# EAGLE schematic voltage_reference (EAGLE 7.5.0)
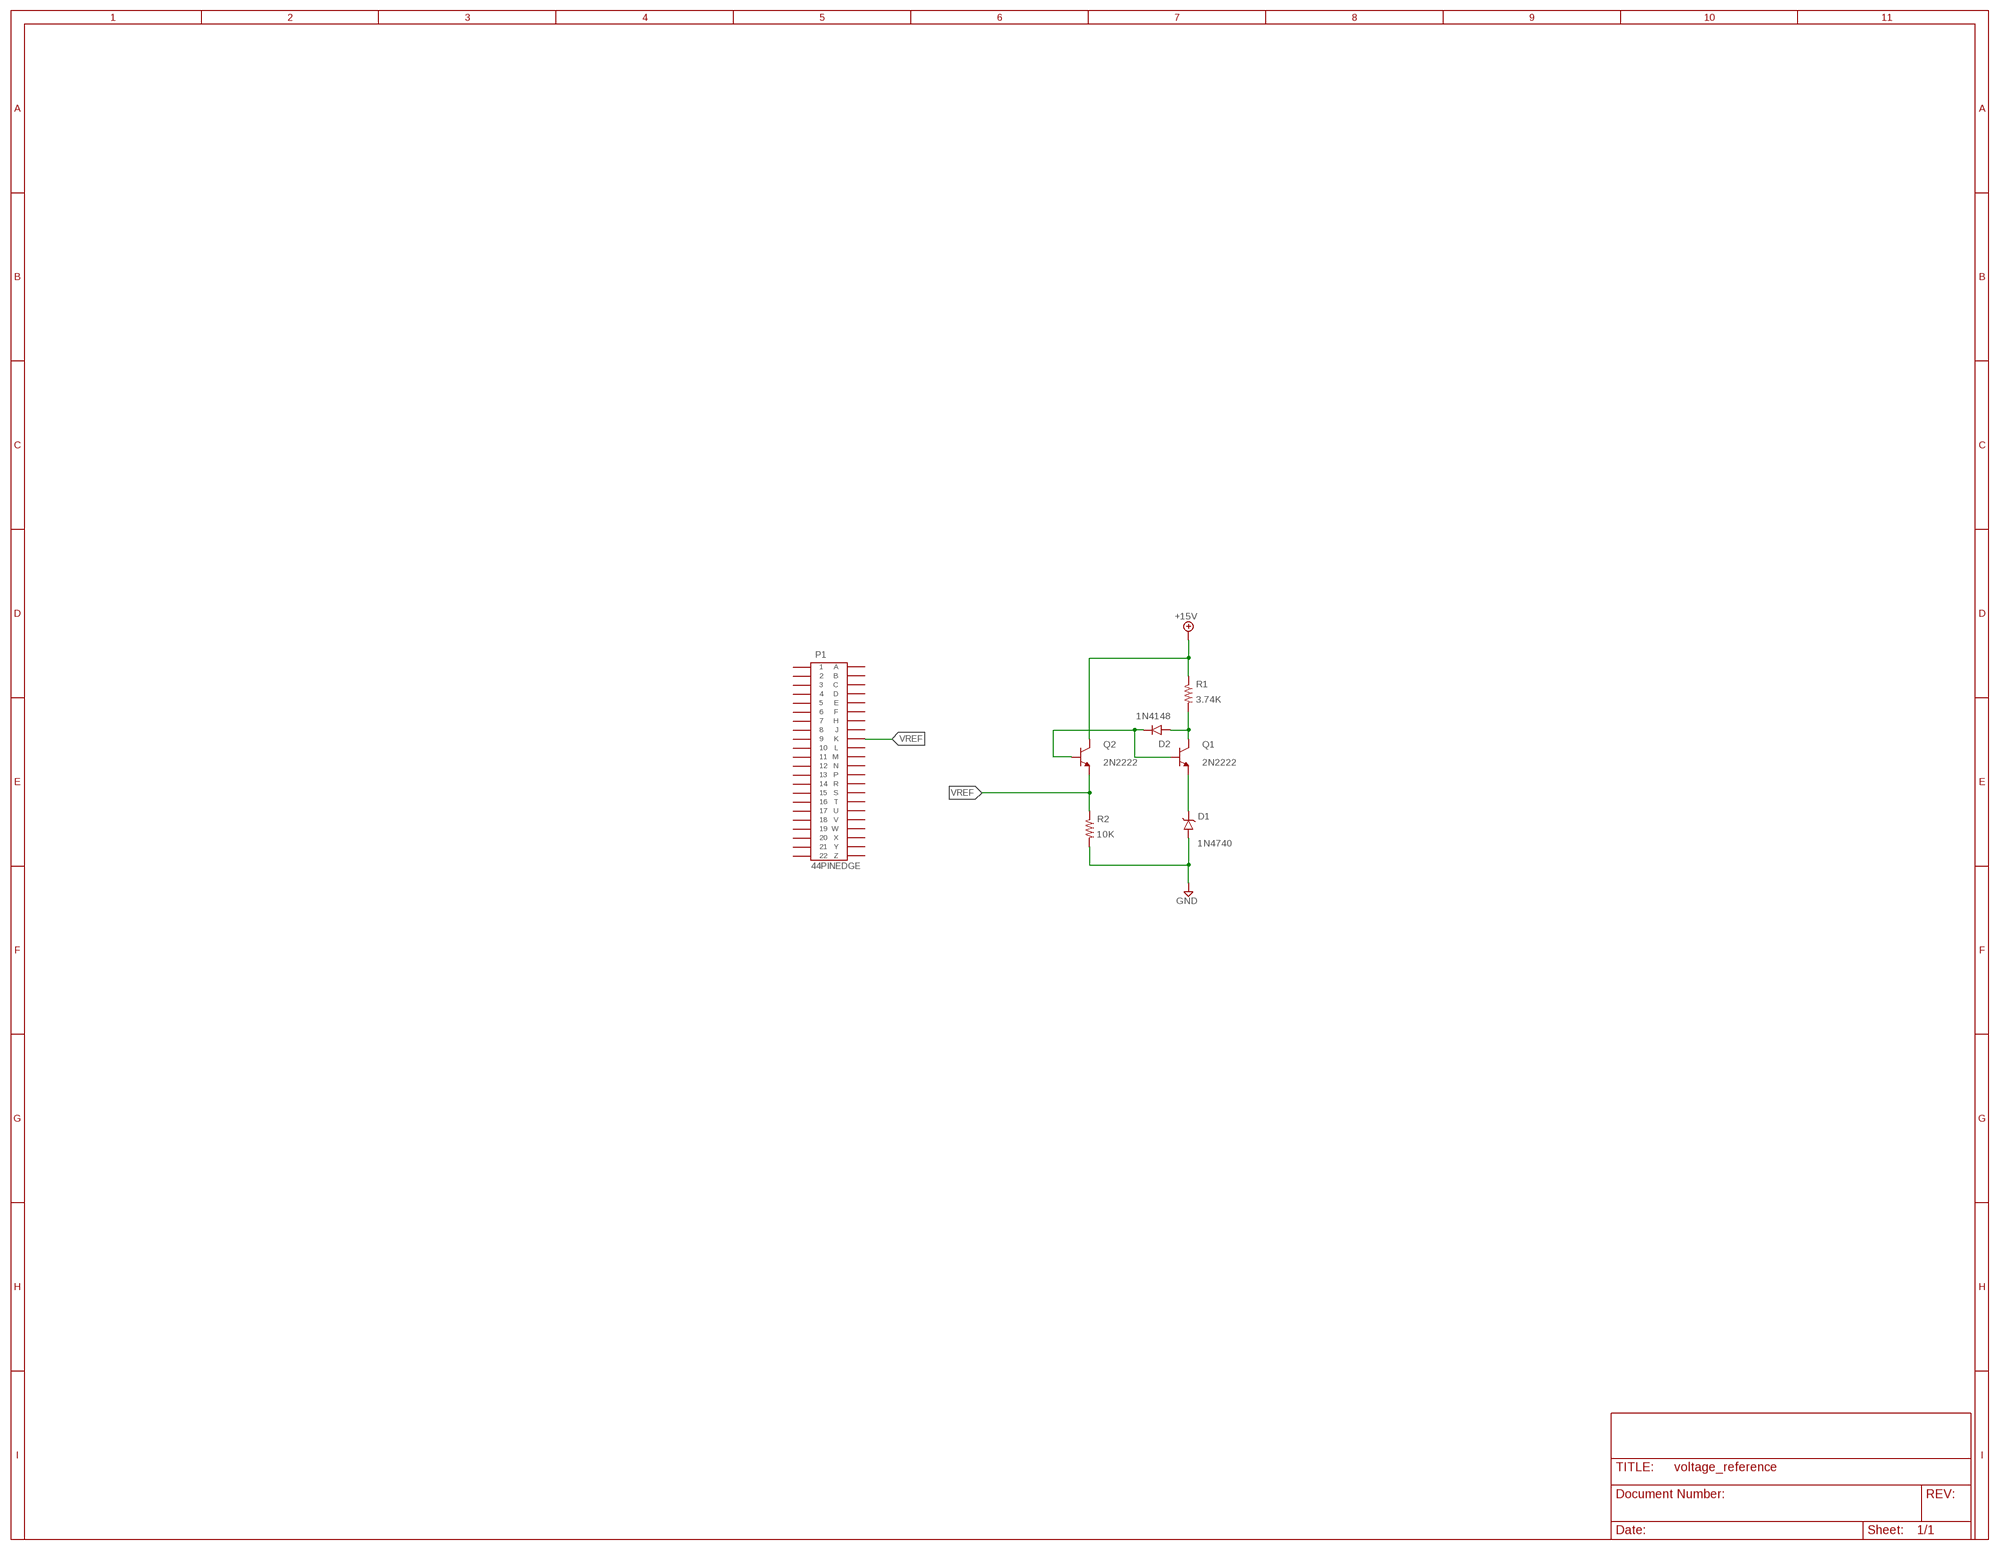
[diagram p0: schematic, sheet 1]

## Parts
D1  1N4740  [DO41]
D2  1N4148  [DO35-7]
P1  44PINEDGE  [44PINEDGE]
Q1  2N2222  [TO18]
Q2  2N2222  [TO18]
R1  3.74K  R-1/4WATT  [0207/10]
R2  10K  R-1/4WATT  [0207/10]

## Nets
+15V: Q2.3(C) R1.1
GND: D1.A R2.2
N$2: D1.C Q1.1(E)
N$3: D2.A Q1.3(C) R1.2
N$37: D2.C Q1.2(B) Q2.2(B)
VREF: P1.K Q2.1(E) R2.1
Unconnected: P1.1 P1.2 P1.3 P1.4 P1.5 P1.6 P1.7 P1.8 P1.9 P1.10 P1.11 P1.12 P1.13 P1.14 P1.15 P1.16 P1.17 P1.18 P1.19 P1.20 P1.21 P1.22 P1.A P1.B P1.C P1.D P1.E P1.F P1.H P1.J P1.L P1.M P1.N P1.P P1.R P1.S P1.T P1.U P1.V P1.W P1.X P1.Y P1.Z

## Library data of the parts
D1 = keiths:1N4740: Z DIODE 10 V, 1W, 5 percent
D2 = keiths:1N4148: High Conductance Fast Diode
P1 = keiths:44PINEDGE: 44 PIN EDGE CONNECTOR FOR PCB
Q1 Q2 = keiths:2N2222: NPN Transistor; PN: 2N2222A
R1 R2 = keiths:R-1/4WATT: Quarter watt through hole resistor.